# Altium project watch_PCB.PrjPcb
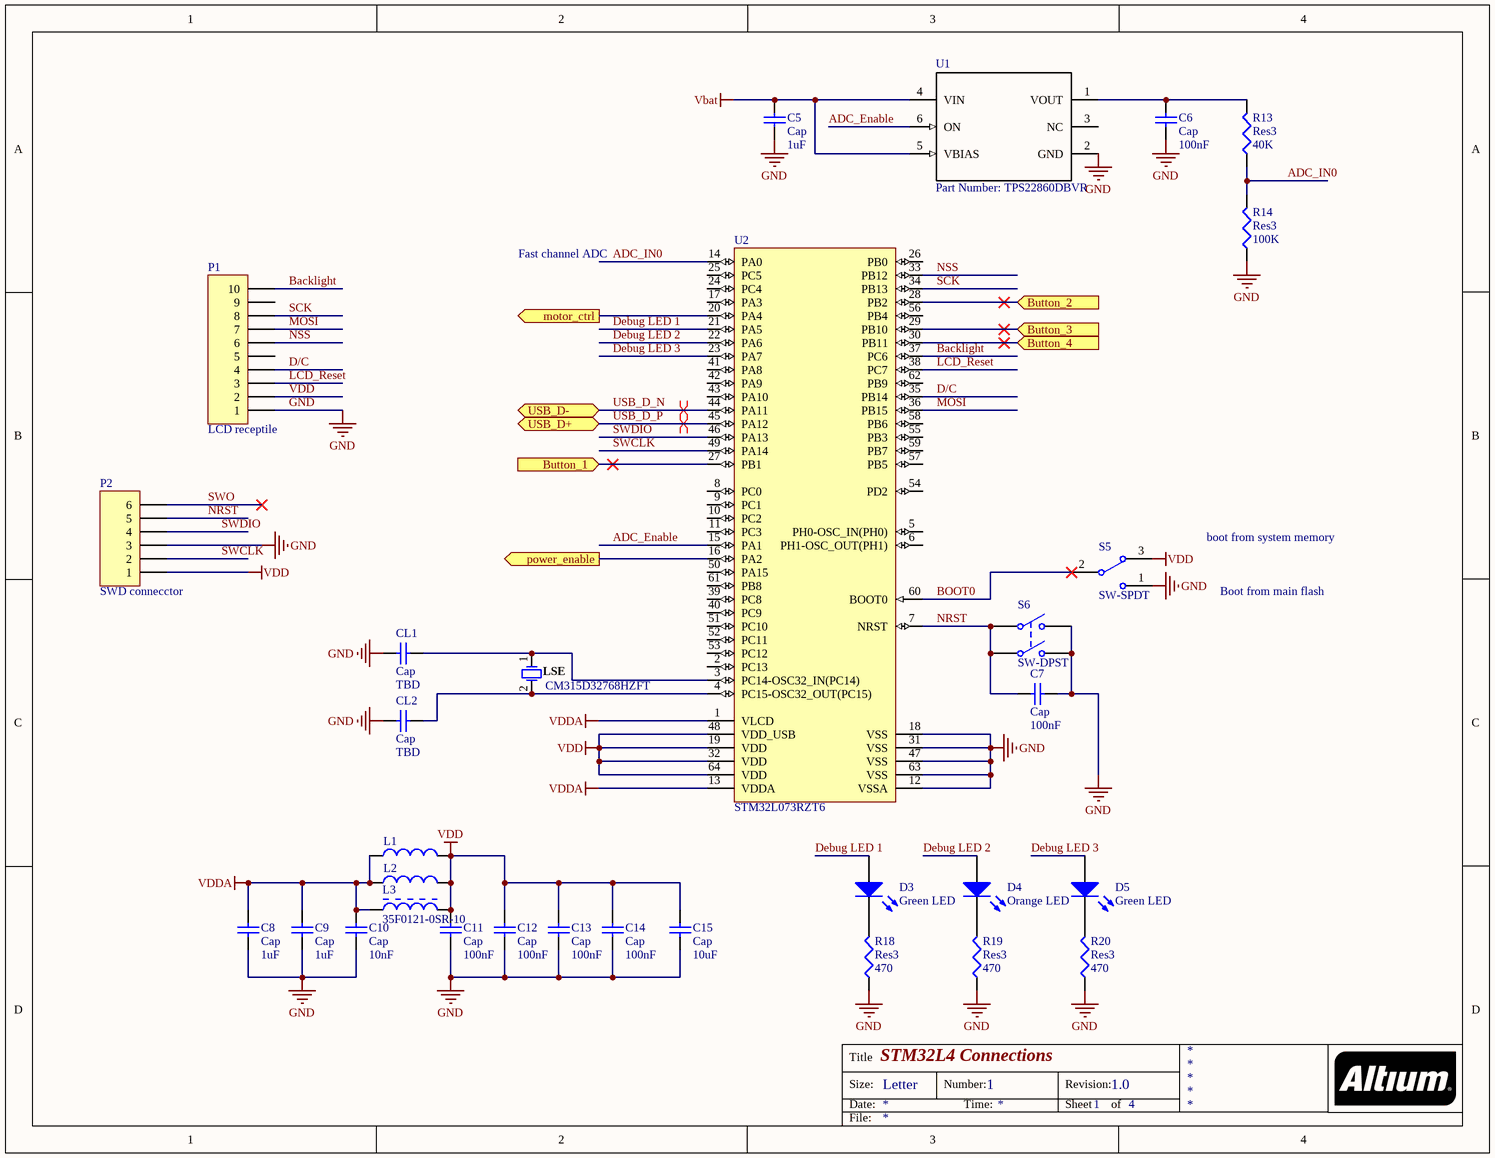
[diagram p0: MCU_Connections.SchDoc]
4 sheets, 71 parts. Net scope: flat (ports and power ports of the same name join across sheets).
Board files: watch_PCB.PcbDoc, watch_PCB2.PcbDoc
Sheets:
  MCU_Connections.SchDoc
  power_supply.SchDoc
  Button_connections.SchDoc
  Motor_Driver_Schematic.SchDoc

## Sheet MCU_Connections.SchDoc: STM32L4 Connections
size Letter; DrawnBy: Zach Haviland; DocumentNumber: 1; Revision: 1.0; SheetNumber: 1; SheetTotal: 4

### Parts
C5  Cap  value 1uF  [C0805]
C6  Cap  value 100nF  [C0805]
C7  Cap  value 100nF  [C0805]
C8  Cap  value 1uF  [C0805]
C9  Cap  value 1uF  [C0805]
C10  Cap  value 10nF  [C0805]
C11  Cap  value 100nF  [C0805]
C12  Cap  value 100nF  [C0805]
C13  Cap  value 100nF  [C0805]
C14  Cap  value 100nF  [C0805]
C15  Cap  value 10uF  [C0805]
CL1  Cap  value TBD  [C0805]
CL2  Cap  value TBD  [C0805]
D3  Green LED  [3.2X1.6X1.1]
D4  Orange LED  [3.2X1.6X1.1]
D5  Green LED  [3.2X1.6X1.1]
L1  (no value)  [C0805]
L2  (no value)  [C1206]
L3  35F0121-0SR-10  [LIRD-35F0121-0SR-10_V]
LSE  CM315D32768HZFT  [CMHT-CM315D-2_V]
P1  LCD receptile  [HDR1X10]
P2  SWD connecctor  [HDR1X6]
R13  Res3  value 40K  [1608[0603]]
R14  Res3  value 100K  [1608[0603]]
R18  Res3  value 470  [1608[0603]]
R19  Res3  value 470  [1608[0603]]
R20  Res3  value 470  [1608[0603]]
S5  SW-SPDT  [HDR1X3]
S6  SW-DPST  [PCBComponent_1]
U1  Part Number: TPS22860DBVR  [DBV0006A_N]
U2  STM32L073RZT6  [STM-LQFP64_M]

### Ports
Button_1 (in), Button_2 (in), Button_3 (in), Button_4 (in), motor_ctrl (out), power_enable (out), USB_D+ (bidir), USB_D- (bidir)

### Nets
GND: C5.1 C6.1 C7.2 C8.1 C9.1 C10.1 C11.1 C12.1 C13.1 C14.1 C15.1 CL1.1 CL2.1 P1.1 P2.3 R14.1 R18.1 R19.1 R20.1 S5.1 S6.2(NO1) S6.4(NO2) U1.2(GND) U2.12(VSSA) U2.18(VSS) U2.31(VSS) U2.47(VSS) U2.63(VSS)
Vbat: C5.2 U1.4(VIN) U1.5(VBIAS)
VDD: C11.2 C12.2 C13.2 C14.2 C15.2 L1.2 L2.2 L3.2 P1.2 P2.1 S5.3 U2.19(VDD) U2.32(VDD) U2.48(VDD_USB) U2.64(VDD)
VDDA: C8.2 C9.2 C10.2 L1.1 L2.1 L3.1 U2.1(VLCD) U2.13(VDDA)
ADC_Enable: U1.6(ON) U2.15(PA1)
ADC_IN0: R13.1 R14.2 U2.14(PA0)
Backlight: P1.10 U2.37(PC6)
BOOT0: S5.2 U2.60(BOOT0)
D/C: P1.4 U2.35(PB14)
Debug LED 1: D3.1(A) U2.21(PA5)
Debug LED 2: D4.1(A) U2.22(PA6)
Debug LED 3: D5.1(A) U2.23(PA7)
LCD_Reset: P1.3 U2.38(PC7)
MOSI: P1.7 U2.36(PB15)
NRST: C7.1 P2.5 S6.1(COMMON1) S6.3(COMMON2) U2.7(NRST)
NSS: P1.6 U2.33(PB12)
SCK: P1.8 U2.34(PB13)
SWCLK: P2.2 U2.49(PA14)
SWDIO: P2.4 U2.46(PA13)
SWO: P2.6
USB_D_N: U2.44(PA11) ; port USB_D-
USB_D_P: U2.45(PA12) ; port USB_D+
NetC6_2: C6.2 R13.2 U1.1(VOUT)
NetCL1_2: CL1.2 LSE.1 U2.3(PC14-OSC32_IN(PC14))
NetCL2_2: CL2.2 LSE.2 U2.4(PC15-OSC32_OUT(PC15))
NetD3_2: D3.2(K) R18.2
NetD4_2: D4.2(K) R19.2
NetD5_2: D5.2(K) R20.2
NetR5_1: U2.27(PB1) ; port Button_1
NetR6_1: U2.28(PB2) ; port Button_2
NetR7_1: U2.29(PB10) ; port Button_3
NetR8_1: U2.30(PB11) ; port Button_4
NetS7_1: U2.16(PA2) ; port power_enable
NetU2_20: U2.20(PA4) ; port motor_ctrl

Not connected (* = marked no-connect by the designer): P1 5 9; U1 3(NC); U2 2(PC13) 5(PH0-OSC_IN(PH0)) 6(PH1-OSC_OUT(PH1)) 8(PC0) 9(PC1) 10(PC2) 11(PC3) 17(PA3) 24(PC4) 25(PC5) 26(PB0) 39(PC8) 40(PC9) 41(PA8) 42(PA9) 43(PA10) 50(PA15) 51(PC10) 52(PC11) 53(PC12) 54(PD2) 55(PB3) 56(PB4) 57(PB5) 58(PB6) 59(PB7) 61(PB8) 62(PB9)

### Layout directives
differential pair: USB_D_N, USB_D_P

### Notes on the sheet
- Fast channel ADC
- boot from system memory
- Boot from main flash
- Caps dependant on board capacitance. Apprxomate range 21pF to 11pF. Refer to page 29 of notebook for calculation
- looking for explanation on caps for VDDA.
  following bypass cap convention (smallest cap near device)? if true, should fix schematic
- Title
- Size:
- Date:
- Letter
- Number:
- Time:
- Revision:
- Sheet
- of
- File:

### Library data of the parts
C5-C15 CL1 CL2 = Cap: Capacitor; Published: 8-Jun-2000; LatestRevisionDate: 17-Jul-2002; LatestRevisionNote: Re-released for DXP Platform.; PackageReference: RAD-0.3; Publisher: Altium Limited; PackageDescription: Radial Cap, Thru-Hole; 2 Leads; 0.3 in Pin Spacing
D3-D5 = LED2: Typical RED, GREEN, YELLOW, AMBER GaAs LED; Published: 8-Jun-2000; LatestRevisionDate: 17-Jul-2002; LatestRevisionNote: Re-released for DXP Platform.; PackageVersion: Feb-2002; PackageReference: 3.2X1.6X1.1; Publisher: Altium Limited; PackageDescription: SM LED; 2 Flat Leads
L1 L2 = Inductor: Code_IEC: 1005; Published: 8-Jun-2000; LatestRevisionDate: 29-May-2009; LatestRevisionNote: IPC-7351 Footprint Added.; PackageReference: 0402-A; Publisher: Altium Limited; PackageDescription: Chip Inductor; Code_JEITA: 0402
L3 = CMP-2000-05596-1: EMI Filtering & RF Inductor, 10 A, 0.75 mOhm, -40 to 125 degC, 2-Pin SMD, RoHS, Tape and Reel; Manufacturer: Laird; Online Catalog: ChipBeads-PowerFiltering; Kits: 240-2227-ND-KITEMIFERRITEBEADCHIPSMD; Catalog Drawings: (28,35)F0121-0SR-10; Other Names: 240-2520-1; Number of Lines: 1; Filter Type: PowerLine; Impedance @ Frequency: 41Ohm@100MHz; Current Rating (Max): 10A; Datasheet URL: https://assets.lairdtech.com/home/brandworld/files/35F0121-0SR-10.pdf; Category: Filters; Packaging: CutTape(CT); Operating Temperature: -40°C~125°C; Family: FerriteBeadsandChips; Series: 35; Ratings: -; Package Description: 2-Pin Surface Mount Device, Body 4.06 x 3.05 mm; Datasheet Version: Rev. F, 04/2015; Mounting Technology: SurfaceMount; Package URL: http://cdn.lairdtech.com/home/brandworld/files/35F0121-0SR-10.pdf; Package Reference: 35F0121-0SR-10; DC Resistance (DCR) (Max): 0.75mOhm; Manufacturer URL: https://www.lairdtech.com/; Standard Package: 1; Package / Case: 2-SMD,J-Lead; Mounting Type: SurfaceMount
LSE = CMP-2000-05089-1: Turning Fork Crystal Unit, 32.768 KHz, -40 to 85 degC, 2-Pin SMD, RoHS, Tape and Reel. Note: Part from altium library is a DZFT, renamed to HZFT to reflect part that's actually going to be used; Manufacturer: Citizen Micro HumanTech; Package Version: Rev. 1.4, 09/2012; Package Reference: CM315D-2; Package Description: 2-Pin Surface Mount Device, Body 1.6 x 3.3 mm, Pitch 2.5 mm; Package URL: http://cfm.citizen.co.jp/english/product/pdf/CM315D.pdf; Manufacturer URL: http://www.citizen-systems.com/us/start; Datasheet Version: Rev. 1.4, 09/2012; Datasheet URL: http://cfm.citizen.co.jp/english/product/pdf/CM315D.pdf
P1 = Header 10: Header, 10-Pin; LatestRevisionDate: 17-Jul-2002; LatestRevisionNote: Re-released for DXP Platform.; Publisher: Altium Limited
P2 = Header 6: Header, 6-Pin; LatestRevisionDate: 17-Jul-2002; LatestRevisionNote: Re-released for DXP Platform.; Publisher: Altium Limited
R13 R14 R18-R20 = Res3: Resistor; Published: 8-Jun-2000; LatestRevisionDate: 29-May-2009; LatestRevisionNote: IPC-7351 Footprint Added.; PackageReference: J1-0603; Publisher: Altium Limited; PackageDescription: Chip Resistor
S5 = SW-SPDT: SPDT Subminiature Toggle Switch, Right Angle Mounting, Vertical Actuation; Published: 24-Mar-1999; LatestRevisionDate: 17-Dec-2003; LatestRevisionNote: Schematic revised, PCB Footprint replaced.; DatasheetVersion: 05-Dec-2000; PackageReference: TL36WW15050; Publisher: Altium Limited; PackageDescription: Switch; 4 Leads; ComponentLink1Description: Manufacturer Link; ComponentLink1URL: http://www.apem.com
S6 = SW-DPST: Double-Pole, Single-Throw Switch; Published: 24-Mar-1999; LatestRevisionDate: 17-Jul-2002; LatestRevisionNote: Re-released for DXP Platform.; PackageReference: DPST-4; Publisher: Altium Limited; PackageDescription: Switch; 4 Leads
U1 = TPS22860DBVR: No Description Available; Vendor: Texas Instruments; Built_By: Texas_Instrument_Team; CompType: IC; Manufacturer_Part_Number: TPS22860DBVR; Copyright: Copyright (C) 2018 Accelerated Designs. All rights reserved; RefDes: RefDes; Type: DEV; Value: Value; Application_BuildNumber: *; PartNumber: TPS22860DBVR; PackageReference: DBV0006A; MountType: SMT; RoHS: Y; Manufacturer: Texas Instruments
U2 = CMP-1546-00073-1: Ultra-Low-Power ARM Cortex-M0+ MCU, 192 KB Flash, 20 KB Internal RAM, 51 I/Os, 64-Pin LQFP, -40 to 85 degC, Tray; Internal RAM Size (kB): 20; Data E2PROM nom (B): 6144; FLASH Size (Prog) (kB): 192; Operating Frequency(F) (Processor speed) (MHz): 32; D/A Converter: 2; I/Os (High Current): 51; Supply Voltage(Vcc) min (V): 1.8; ComponentLink1Description: Manufacturer URL; ComponentLink2Description: Datasheet; DatasheetVersion: Rev. 2; Mounting Technology: Surface Mount; Package Description: 64-Pin Low-profile Quad Flat Package, Body 10 x 10 mm, Pitch 0.5 mm; ComponentLink2URL: http://www.st.com/st-web-ui/static/active/en/resource/technical/document/datasheet/DM00141036.pdf; Core: ARM Cortex-M0+; Packing: Tray; ComponentLink1URL: http://www.st.com/; Package Reference: LQFP64

## Sheet power_supply.SchDoc: Watch Power Circuit
size Letter; Author: Zach Haviland; DrawnBy: Zach Haviland; DocumentNumber: 2; Revision: 1.0; SheetNumber: 2; SheetTotal: 4
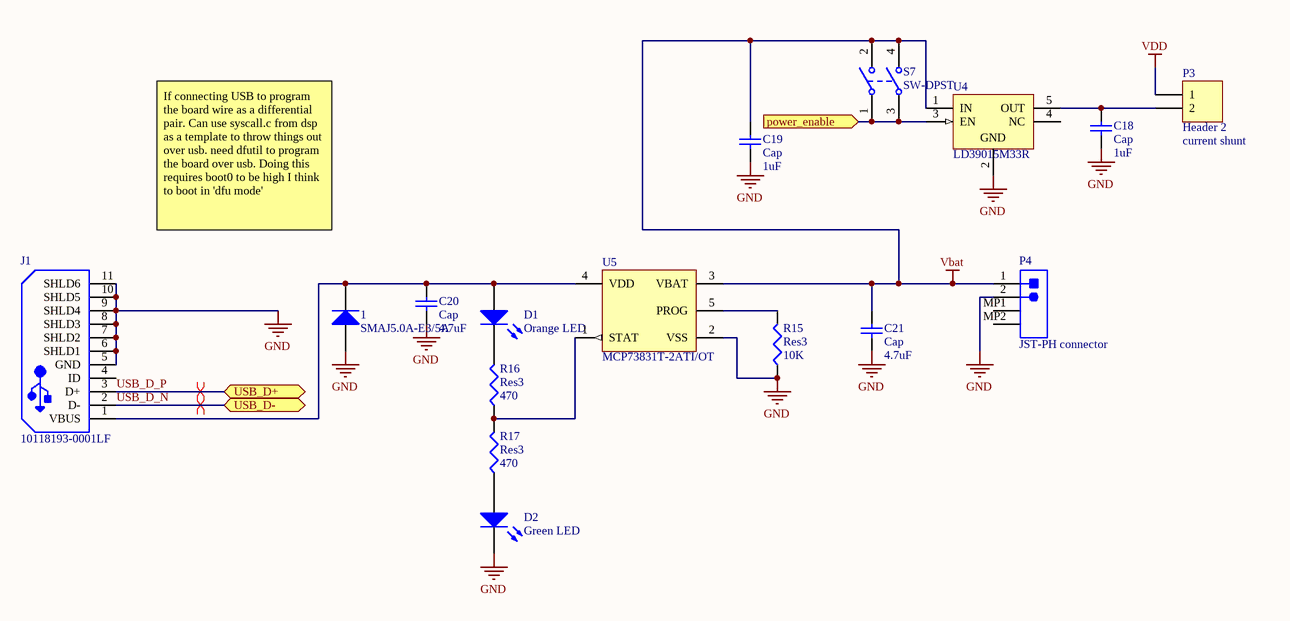
[diagram p1: power_supply.SchDoc]

### Parts
1  SMAJ5.0A-E3/5A  [VISH-DO-214AC-2_N]
C18  Cap  value 1uF  [C0805]
C19  Cap  value 1uF  [C0805]
C20  Cap  value 4.7uF  [C0805]
C21  Cap  value 4.7uF  [C0805]
D1  Orange LED  [3.2X1.6X1.1]
D2  Green LED  [3.2X1.6X1.1]
J1  10118193-0001LF  [FCI-10118193-0001LF-5_V]
P3  Header 2  [HDR1X2]
P4  JST-PH connector  [JST- S2B-PH-SM4-TB(LF)(SN)-2_V]
R15  Res3  value 10K  [1608[0603]]
R16  Res3  value 470  [1608[0603]]
R17  Res3  value 470  [1608[0603]]
S7  SW-DPST  [PCBComponent_1]
U4  LD39015M33R  [SOT23-5L_N]
U5  MCP73831T-2ATI/OT  [SOT-23-OT5_N]

### Ports
power_enable (in), USB_D+ (bidir), USB_D- (bidir)

### Nets
GND: 1.2(A) C18.1 C19.1 C20.1 C21.1 D2.2(K) J1.5(GND) J1.6(SHLD1) J1.7(SHLD2) J1.8(SHLD3) J1.9(SHLD4) J1.10(SHLD5) J1.11(SHLD6) P4.2 R15.1 U4.2(GND) U5.2(VSS)
Vbat: C19.2 C21.2 P4.1 S7.2(NO1) S7.4(NO2) U4.1(IN) U5.3(VBAT)
VDD: P3.1
USB_D_N: J1.2(D-) ; port USB_D-
USB_D_P: J1.3(D+) ; port USB_D+
Net1_1: 1.1(K) C20.2 D1.1(A) J1.1(VBUS) U5.4(VDD)
NetC18_2: C18.2 P3.2 U4.5(OUT)
NetD1_2: D1.2(K) R16.2
NetD2_1: D2.1(A) R17.1
NetR15_2: R15.2 U5.5(PROG)
NetR16_1: R16.1 R17.2 U5.1(STAT)
NetS7_1: S7.1(COMMON1) S7.3(COMMON2) U4.3(EN) ; port power_enable

Not connected (* = marked no-connect by the designer): J1 4(ID); P4 MP1 MP2; U4 4(NC)

### Layout directives
differential pair: USB_D_N, USB_D_P

### Notes on the sheet
- (near P3) current shunt
- If connecting USB to program the board wire as a differential pair. Can use syscall.c from dsp as a template to throw things out over usb. need dfutil to program the board over usb. Doing this requires boot0 to be high I think to boot in 'dfu mode'
- Title
- Size:
- Date:
- Letter
- Number:
- Time:
- Revision:
- Sheet
- of
- File:

### Library data of the parts
1 = CMP-0548-00320-2: Transient Voltage Suppressor, 6.40 to 231 V, 5 V Stand-off Voltage, Uni-Directional, -55 to 155 degC, 2-pin DO-214AC, Pb-Free, Tape and Reel; Manufacturer: Vishay Semiconductor; PPPM (W): 400, 300; VWM (V): 5; ID (uA): 800; IFSM: 40 A; VBR Uni-Directional (V): 6.4 to 231; PackageReference: DO-214AC-2; Operating Junction and Storage Temperature Range: -55 to 150 degC; ComponentLink1URL: http://www.vishay.com/; ComponentLink3Description: Package Specification; ComponentLink1Description: Manufacturer URL; ComponentLink2Description: Datasheet; PartNumber: SMAJ5.0A-E3/5A; RoHS: TRUE; DatasheetVersion: 12/8/2013; Packing: Tape and Reel; ComponentLink2URL: http://www.vishay.com/docs/88390/smaj50a.pdf; ComponentLink3URL: http://www.vishay.com/docs/88390/smaj50a.pdf; PackageDescription: 2-Pin DO-214AC (SMA), Body 4.245 x 2.665 mm; Mounting Technology: Surface Mount
C18-C21 = Cap: Capacitor; Published: 8-Jun-2000; LatestRevisionDate: 17-Jul-2002; LatestRevisionNote: Re-released for DXP Platform.; PackageReference: RAD-0.3; Publisher: Altium Limited; PackageDescription: Radial Cap, Thru-Hole; 2 Leads; 0.3 in Pin Spacing
D1 D2 = LED2: as D3 on sheet MCU_Connections; Published: 8-Jun-2000; LatestRevisionDate: 17-Jul-2002; LatestRevisionNote: Re-released for DXP Platform.; PackageVersion: Feb-2002; PackageReference: 3.2X1.6X1.1; Publisher: Altium Limited; PackageDescription: SM LED; 2 Flat Leads
J1 = CMP-2000-05119-1: Micro USB B Type Receptacle, -55 to 85 degC, 5-Pin SMD, RoHS, Tape and Reel; Manufacturer: FCI; Insulation Resistance: 1000MOhms; Gender: Female; Current Rating: 1.8A; Number of Contacts: 5Contact; Connector Type: MicroUSBTypeBreceptacle; Mounting Angle: Right; Datasheet Version: Rev. C, 05/2015; Packaging: Reel; Product Category: USBConnectors; Standard: USB2.0; Factory Pack Quantity: 1200; Operating Temperature Range: -55Cto+85C; Termination Style: SMD/SMT; Datasheet URL: http://datasheet.octopart.com/10118193-0001LF-FCI-datasheet-55953155.pdf; Contact Material: CopperAlloy; RoHS: Details; Contact Plating: Gold; Flammability Rating: UL94V-0; Manufacturer URL: http://www.fci.com/; Brand: FCI; Product: MicroUSBTypeBConnectors; Color: Black
P3 = Header 2: Header, 2-Pin; LatestRevisionDate: 17-Jul-2002; LatestRevisionNote: Re-released for DXP Platform.; Publisher: Altium Limited
P4 = CMP-1755-00001-1: Male Header, Pitch 2 mm, 1 x 2 Position, Height 5.5 mm, -25 to 85 degC, RoHS, Tape and Reel; Current Rating: 3 A; ComponentLink1URL: http://www.jst.com/home2.html; Radiation Hardening: No; RoHSCompliant: True; Mount: Through Hole; Contact Material: Bronze; Package Quantity: 100; Width: 2.34 mm; DatasheetVersion: Dec-12; Height: 8.13 mm; Max Operating Temperature: 105degC; ComponentLink2Description: Datasheet; Lead Pitch: 0.1 inch; Contact Finish: Lead; Packaging: Bulk; Colour: Black; Contact Plating: Tin; Min Operating Temperature: -65degC; ComponentLink1Description: Manufacturer URL; PackageReference: S2B-PH-SM4-TB(LF)(SN)-2; PackageDescription: Male Header, Pitch 2 mm, 1 x 2 Position, Height 5.5 mm; ComponentLink2URL: http://www.jst-mfg.com/product/pdf/eng/ePH.pdf; Pins: 40; Length: 101.19 mm
R15-R17 = Res3: Resistor; Published: 8-Jun-2000; LatestRevisionDate: 29-May-2009; LatestRevisionNote: IPC-7351 Footprint Added.; PackageReference: J1-0603; Publisher: Altium Limited; PackageDescription: Chip Resistor
S7 = SW-DPST: Double-Pole, Single-Throw Switch; Published: 24-Mar-1999; LatestRevisionDate: 17-Jul-2002; LatestRevisionNote: Re-released for DXP Platform.; PackageReference: DPST-4; Publisher: Altium Limited; PackageDescription: Switch; 4 Leads
U4 = CMP-0244-00351-1: 150 mA Low Quiescent Current Low Noise Voltage Regulator, 3.3V, 5-Pin SOT-23, Tape and Reel; PackageReference: SOT23-5L; ComponentLink1URL: http://www.st.com; PackageDescription: 5-Pin SOT-23 Package, 2.9 x 1.6 mm Body, 0.95 mm Pitch, 2.8 mm Lead Span; ComponentLink2Description: Datasheet; DatasheetVersion: 1/02/2009; ComponentLink1Description: Manufacturer URL; ComponentLink2URL: http://www.st.com/internet/com/TECHNICAL_RESOURCES/TECHNICAL_LITERATURE/DATASHEET/CD00173477.pdf; PackageVersion: 1/01/2008
U5 = CMP-0133-00144-1: Miniature Single-Cell, Fully Integrated Li-Ion, Li-Polymer Charge Management Controller, 4.2V, 5-Pin SOT-23, Industrial Temperature, Tape and Reel; DatasheetVersion: revE, Sep-2008; PackageVersion: revBB, Aug-2009; PackageReference: SOT-23-OT5; PackageDescription: 5-Lead Plastic Small Outline Transistor (OT) [SOT-23]; Code_IPC: SOT23-5

## Sheet Button_connections.SchDoc: Digital Watch Button Schematic
size Letter; DrawnBy: Zach Haviland; DocumentNumber: 3; Revision: 1; SheetNumber: 3; SheetTotal: 4
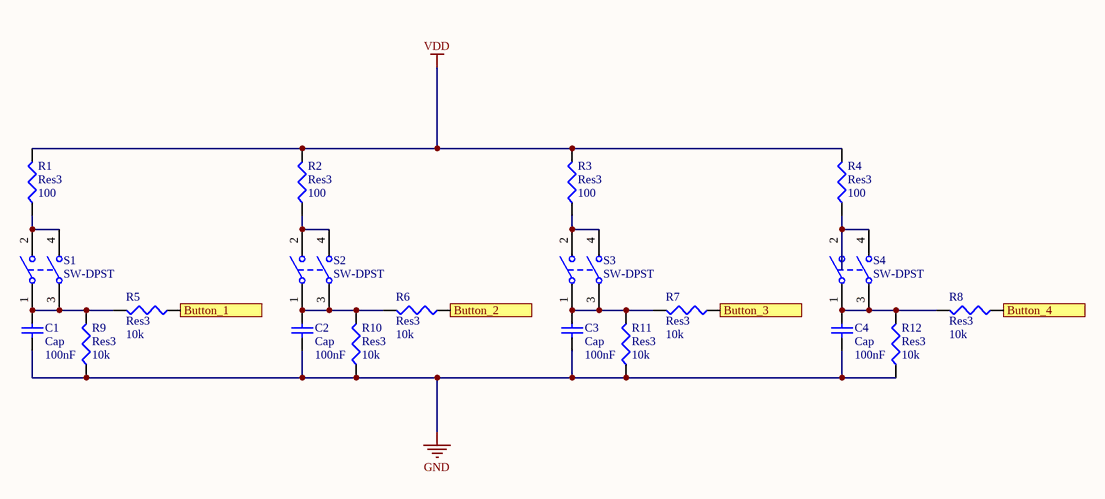
[diagram p2: Button_connections.SchDoc]

### Parts
C1  Cap  value 100nF  [C0805]
C2  Cap  value 100nF  [C0805]
C3  Cap  value 100nF  [C0805]
C4  Cap  value 100nF  [C0805]
R1  Res3  value 100  [1608[0603]]
R2  Res3  value 100  [1608[0603]]
R3  Res3  value 100  [1608[0603]]
R4  Res3  value 100  [1608[0603]]
R5  Res3  value 10k  [1608[0603]]
R6  Res3  value 10k  [1608[0603]]
R7  Res3  value 10k  [1608[0603]]
R8  Res3  value 10k  [1608[0603]]
R9  Res3  value 10k  [1608[0603]]
R10  Res3  value 10k  [1608[0603]]
R11  Res3  value 10k  [1608[0603]]
R12  Res3  value 10k  [1608[0603]]
S1  SW-DPST  [PCBComponent_1]
S2  SW-DPST  [PCBComponent_1]
S3  SW-DPST  [PCBComponent_1]
S4  SW-DPST  [PCBComponent_1]

### Ports
Button_1 (out), Button_2 (out), Button_3 (out), Button_4 (out)

### Nets
GND: C1.1 C2.1 C3.1 C4.1 R9.1 R10.1 R11.1 R12.1
VDD: R1.2 R2.2 R3.2 R4.2
NetC1_2: C1.2 R5.2 R9.2 S1.1(COMMON1) S1.3(COMMON2)
NetC2_2: C2.2 R6.2 R10.2 S2.1(COMMON1) S2.3(COMMON2)
NetC3_2: C3.2 R7.2 R11.2 S3.1(COMMON1) S3.3(COMMON2)
NetC4_2: C4.2 R8.2 R12.2 S4.1(COMMON1) S4.3(COMMON2)
NetR1_1: R1.1 S1.2(NO1) S1.4(NO2)
NetR2_1: R2.1 S2.2(NO1) S2.4(NO2)
NetR3_1: R3.1 S3.2(NO1) S3.4(NO2)
NetR4_1: R4.1 S4.2(NO1) S4.4(NO2)
NetR5_1: R5.1 ; port Button_1
NetR6_1: R6.1 ; port Button_2
NetR7_1: R7.1 ; port Button_3
NetR8_1: R8.1 ; port Button_4

### Notes on the sheet
- Debounce circuit has 2nd 10k resistor in wrong spot. Should be between button+cap node and other 10k node. Please fix before doing next PCB revision.
- Title
- Size:
- Date:
- Letter
- Number:
- Time:
- Revision:
- Sheet
- of
- File:

### Library data of the parts
C1-C4 = Cap: Capacitor; Published: 8-Jun-2000; LatestRevisionDate: 17-Jul-2002; LatestRevisionNote: Re-released for DXP Platform.; PackageReference: RAD-0.3; Publisher: Altium Limited; PackageDescription: Radial Cap, Thru-Hole; 2 Leads; 0.3 in Pin Spacing
R1-R12 = Res3: Resistor; Published: 8-Jun-2000; LatestRevisionDate: 29-May-2009; LatestRevisionNote: IPC-7351 Footprint Added.; PackageReference: J1-0603; Publisher: Altium Limited; PackageDescription: Chip Resistor
S1-S4 = SW-DPST: Double-Pole, Single-Throw Switch; Published: 24-Mar-1999; LatestRevisionDate: 17-Jul-2002; LatestRevisionNote: Re-released for DXP Platform.; PackageReference: DPST-4; Publisher: Altium Limited; PackageDescription: Switch; 4 Leads

## Sheet Motor_Driver_Schematic.SchDoc
size A; DocumentNumber: 4; SheetNumber: 4; SheetTotal: 4
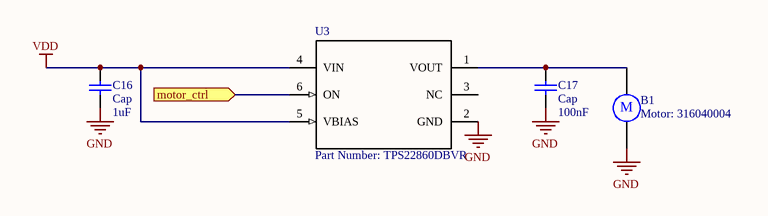
[diagram p3: Motor_Driver_Schematic.SchDoc]

### Parts
B1  Motor: 316040004  [RB5-10.5]
C16  Cap  value 1uF  [C0805]
C17  Cap  value 100nF  [C0805]
U3  Part Number: TPS22860DBVR  [DBV0006A_N]

### Ports
motor_ctrl (in)

### Nets
GND: B1.2 C16.1 C17.1 U3.2(GND)
VDD: C16.2 U3.4(VIN) U3.5(VBIAS)
NetB1_1: B1.1 C17.2 U3.1(VOUT)
NetU2_20: U3.6(ON) ; port motor_ctrl

Not connected (* = marked no-connect by the designer): U3 3(NC)

### Notes on the sheet
- (in symbol Motor) M

### Library data of the parts
B1 = Motor: Motor, General Kind; Published: 24-Mar-1999; LatestRevisionDate: 17-Jul-2002; LatestRevisionNote: Re-released for DXP Platform.; PackageReference: RB5-10.5; Publisher: Altium Limited; PackageDescription: Capacitor (Radial); 2 Leads
C16 C17 = Cap: Capacitor; Published: 8-Jun-2000; LatestRevisionDate: 17-Jul-2002; LatestRevisionNote: Re-released for DXP Platform.; PackageReference: RAD-0.3; Publisher: Altium Limited; PackageDescription: Radial Cap, Thru-Hole; 2 Leads; 0.3 in Pin Spacing
U3 = TPS22860DBVR: as U1 on sheet MCU_Connections; Manufacturer_Part_Number: TPS22860DBVR; Copyright: Copyright (C) 2018 Accelerated Designs. All rights reserved; RefDes: RefDes; Type: DEV; Value: Value; Application_BuildNumber: *; PartNumber: TPS22860DBVR; PackageReference: DBV0006A; MountType: SMT; RoHS: Y; Manufacturer: Texas Instruments

## Nets that join several sheets
GND: MCU_Connections (28 pins), power_supply (17 pins), Button_connections (8 pins), Motor_Driver_Schematic (B1.2 C16.1 C17.1 U3.2)
Vbat: MCU_Connections (C5.2 U1.4 U1.5), power_supply (7 pins)
VDD: MCU_Connections (15 pins), power_supply (P3.1), Button_connections (R1.2 R2.2 R3.2 R4.2), Motor_Driver_Schematic (C16.2 U3.4 U3.5)
NetR5_1: MCU_Connections (U2.27), Button_connections (R5.1)
NetR6_1: MCU_Connections (U2.28), Button_connections (R6.1)
NetR7_1: MCU_Connections (U2.29), Button_connections (R7.1)
NetR8_1: MCU_Connections (U2.30), Button_connections (R8.1)
NetS7_1: MCU_Connections (U2.16), power_supply (S7.1 S7.3 U4.3)
NetU2_20: MCU_Connections (U2.20), Motor_Driver_Schematic (U3.6)
USB_D_N: MCU_Connections (U2.44), power_supply (J1.2)
USB_D_P: MCU_Connections (U2.45), power_supply (J1.3)